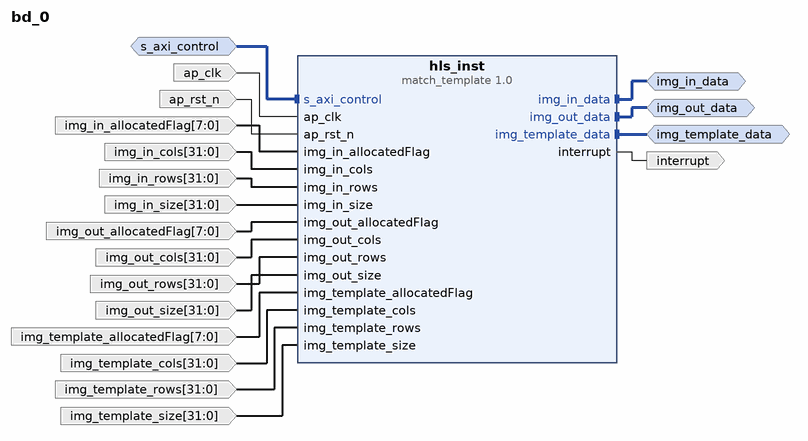
[diagram p0: block diagram of the top level]
# Vivado block design bd_0, xc7s25csga324-1, Vivado 2024.2
create_bd_design bd_0

create_bd_intf_port -mode Master -vlnv xilinx.com:interface:acc_fifo_read_rtl:1.0 img_in_data
create_bd_intf_port -mode Master -vlnv xilinx.com:interface:acc_fifo_write_rtl:1.0 img_out_data
create_bd_intf_port -mode Master -vlnv xilinx.com:interface:acc_fifo_read_rtl:1.0 img_template_data
create_bd_intf_port -mode Slave -vlnv xilinx.com:interface:aximm_rtl:1.0 s_axi_control
set_property -dict [list \
  CONFIG.ADDR_WIDTH 32 \
  CONFIG.ARUSER_WIDTH 0 \
  CONFIG.AWUSER_WIDTH 0 \
  CONFIG.BUSER_WIDTH 0 \
  CONFIG.DATA_WIDTH 32 \
  CONFIG.FREQ_HZ 303000000.0 \
  CONFIG.HAS_BRESP 1 \
  CONFIG.HAS_BURST 0 \
  CONFIG.HAS_CACHE 0 \
  CONFIG.HAS_LOCK 0 \
  CONFIG.HAS_PROT 0 \
  CONFIG.HAS_QOS 0 \
  CONFIG.HAS_REGION 0 \
  CONFIG.HAS_RRESP 1 \
  CONFIG.HAS_WSTRB 1 \
  CONFIG.ID_WIDTH 0 \
  CONFIG.NUM_READ_OUTSTANDING 1 \
  CONFIG.NUM_READ_THREADS 1 \
  CONFIG.NUM_WRITE_OUTSTANDING 1 \
  CONFIG.NUM_WRITE_THREADS 1 \
  CONFIG.PROTOCOL AXI4LITE \
  CONFIG.READ_WRITE_MODE READ_WRITE \
  CONFIG.RUSER_BITS_PER_BYTE 0 \
  CONFIG.RUSER_WIDTH 0 \
  CONFIG.WUSER_BITS_PER_BYTE 0 \
  CONFIG.WUSER_WIDTH 0 \
] [get_bd_intf_ports s_axi_control]
create_bd_port -dir I -type clk ap_clk
set_property -dict {CONFIG.FREQ_HZ 303000000.0} [get_bd_ports ap_clk]
create_bd_port -dir I -type rst ap_rst_n
create_bd_port -dir I -from 7 -to 0 -type data img_in_allocatedFlag
create_bd_port -dir I -from 31 -to 0 -type data img_in_cols
create_bd_port -dir I -from 31 -to 0 -type data img_in_rows
create_bd_port -dir I -from 31 -to 0 -type data img_in_size
create_bd_port -dir I -from 7 -to 0 -type data img_out_allocatedFlag
create_bd_port -dir I -from 31 -to 0 -type data img_out_cols
create_bd_port -dir I -from 31 -to 0 -type data img_out_rows
create_bd_port -dir I -from 31 -to 0 -type data img_out_size
create_bd_port -dir I -from 7 -to 0 -type data img_template_allocatedFlag
create_bd_port -dir I -from 31 -to 0 -type data img_template_cols
create_bd_port -dir I -from 31 -to 0 -type data img_template_rows
create_bd_port -dir I -from 31 -to 0 -type data img_template_size
create_bd_port -dir O -type intr interrupt

create_bd_cell -type ip -vlnv xilinx.com:hls:match_template:1.0 hls_inst

# ---- connections ----

connect_bd_intf_net [get_bd_intf_ports img_in_data] [get_bd_intf_pins hls_inst/img_in_data]
connect_bd_intf_net [get_bd_intf_ports img_out_data] [get_bd_intf_pins hls_inst/img_out_data]
connect_bd_intf_net [get_bd_intf_ports img_template_data] [get_bd_intf_pins hls_inst/img_template_data]
connect_bd_intf_net -intf_net s_axi_control_0_1 [get_bd_intf_ports s_axi_control] [get_bd_intf_pins hls_inst/s_axi_control]
connect_bd_net -net ap_clk_0_1 [get_bd_ports ap_clk] [get_bd_pins hls_inst/ap_clk]
connect_bd_net -net ap_rst_n_0_1 [get_bd_ports ap_rst_n] [get_bd_pins hls_inst/ap_rst_n]
connect_bd_net [get_bd_pins hls_inst/interrupt] [get_bd_ports interrupt]
connect_bd_net -net img_in_allocatedFlag_0_1 [get_bd_ports img_in_allocatedFlag] [get_bd_pins hls_inst/img_in_allocatedFlag]
connect_bd_net -net img_in_cols_0_1 [get_bd_ports img_in_cols] [get_bd_pins hls_inst/img_in_cols]
connect_bd_net -net img_in_rows_0_1 [get_bd_ports img_in_rows] [get_bd_pins hls_inst/img_in_rows]
connect_bd_net -net img_in_size_0_1 [get_bd_ports img_in_size] [get_bd_pins hls_inst/img_in_size]
connect_bd_net -net img_out_allocatedFlag_0_1 [get_bd_ports img_out_allocatedFlag] [get_bd_pins hls_inst/img_out_allocatedFlag]
connect_bd_net -net img_out_cols_0_1 [get_bd_ports img_out_cols] [get_bd_pins hls_inst/img_out_cols]
connect_bd_net -net img_out_rows_0_1 [get_bd_ports img_out_rows] [get_bd_pins hls_inst/img_out_rows]
connect_bd_net -net img_out_size_0_1 [get_bd_ports img_out_size] [get_bd_pins hls_inst/img_out_size]
connect_bd_net -net img_template_allocatedFlag_0_1 [get_bd_ports img_template_allocatedFlag] [get_bd_pins hls_inst/img_template_allocatedFlag]
connect_bd_net -net img_template_cols_0_1 [get_bd_ports img_template_cols] [get_bd_pins hls_inst/img_template_cols]
connect_bd_net -net img_template_rows_0_1 [get_bd_ports img_template_rows] [get_bd_pins hls_inst/img_template_rows]
connect_bd_net -net img_template_size_0_1 [get_bd_ports img_template_size] [get_bd_pins hls_inst/img_template_size]

# ---- address map ----
assign_bd_address -offset 0x00000000 -range 64K -target_address_space [get_bd_addr_spaces s_axi_control] [get_bd_addr_segs hls_inst/s_axi_control/Reg]

validate_bd_design
save_bd_design
